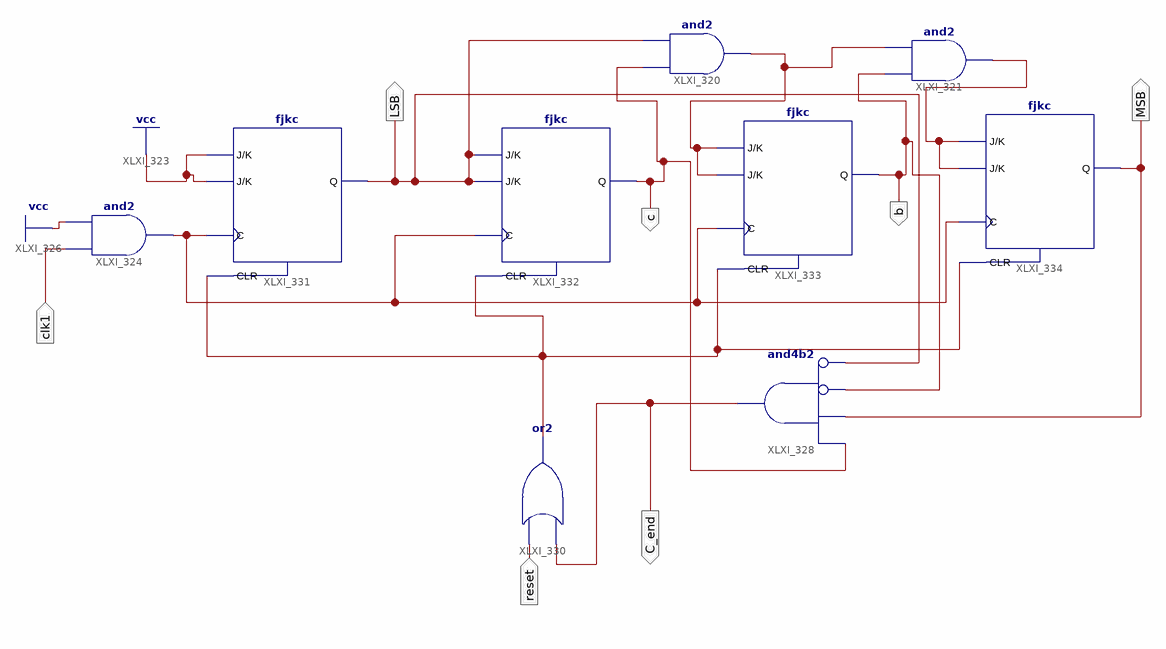
[diagram p0: schematic sheet 1]
// Xilinx ISE schematic Mod10.sch (spartan6) as structural Verilog: 9 symbols, 7 ports
module Mod10 (
  input  clk1,
  input  reset,
  output C_end,
  output MSB,
  output b,
  output c,
  output LSB
);

  wire XLXN_593, XLXN_605, XLXN_612, XLXN_614;

  and XLXI_320 (XLXN_593, c, LSB);
  and XLXI_321 (XLXN_605, b, XLXN_593);
  and XLXI_324 (XLXN_612, clk1, 1'b1);
  or XLXI_330 (XLXN_614, C_end, reset);
  and XLXI_328 (C_end, ~LSB, ~b, MSB, c);  // and4b2
  fjkc XLXI_331 (.C(XLXN_612), .CLR(XLXN_614), .J(1'b1), .K(1'b1), .Q(LSB));
  fjkc XLXI_332 (.C(XLXN_612), .CLR(XLXN_614), .J(LSB), .K(LSB), .Q(c));
  fjkc XLXI_333 (.C(XLXN_612), .CLR(XLXN_614), .J(XLXN_593), .K(XLXN_593), .Q(b));
  fjkc XLXI_334 (.C(XLXN_612), .CLR(XLXN_614), .J(XLXN_605), .K(XLXN_605), .Q(MSB));
endmodule
